# Altium schematic sheet ip_phone_d_lcd_keyboard.SchDoc: LCD e Display
size A3; SheetNumber: 4; SheetTotal: 6
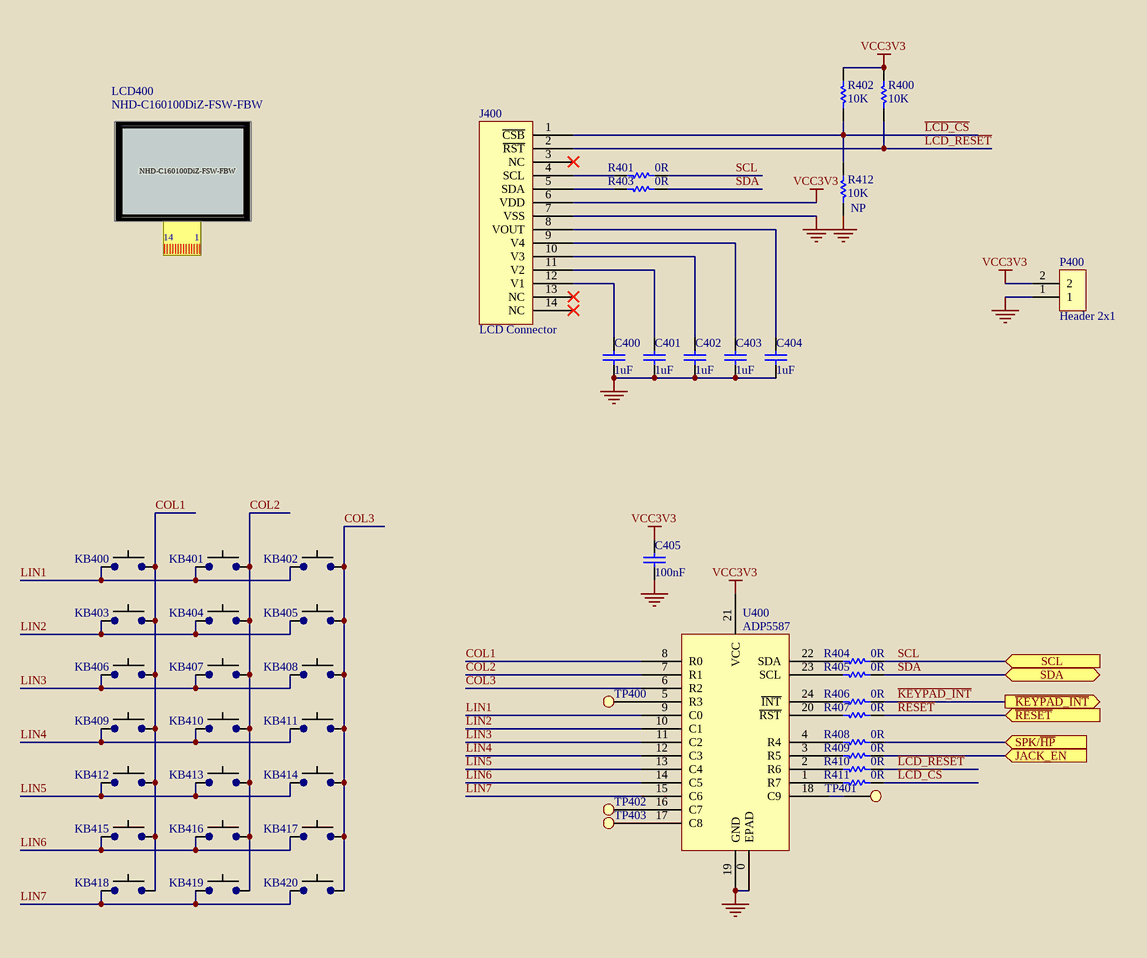
[diagram p0: ip_phone_d_lcd_keyboard.SchDoc]

## Parts
C400  1uF  [CC1005-0402]
C401  1uF  [CC1005-0402]
C402  1uF  [CC1005-0402]
C403  1uF  [CC1005-0402]
C404  1uF  [CC1005-0402]
C405  100nF  [CC1005-0402]
J400  LCD Connector  [LCD_Connector]
KB400  Keypad_Button  [Keypad_Button]  (value not drawn)  (no BOM)
KB401  Keypad_Button  [Keypad_Button]  (value not drawn)  (no BOM)
KB402  Keypad_Button  [Keypad_Button]  (value not drawn)  (no BOM)
KB403  Keypad_Button  [Keypad_Button]  (value not drawn)  (no BOM)
KB404  Keypad_Button  [Keypad_Button]  (value not drawn)  (no BOM)
KB405  Keypad_Button  [Keypad_Button]  (value not drawn)  (no BOM)
KB406  Keypad_Button  [Keypad_Button]  (value not drawn)  (no BOM)
KB407  Keypad_Button  [Keypad_Button]  (value not drawn)  (no BOM)
KB408  Keypad_Button  [Keypad_Button]  (value not drawn)  (no BOM)
KB409  Keypad_Button  [Keypad_Button]  (value not drawn)  (no BOM)
KB410  Keypad_Button  [Keypad_Button]  (value not drawn)  (no BOM)
KB411  Keypad_Button  [Keypad_Button]  (value not drawn)  (no BOM)
KB412  Keypad_Button  [Keypad_Button]  (value not drawn)  (no BOM)
KB413  Keypad_Button  [Keypad_Button]  (value not drawn)  (no BOM)
KB414  Keypad_Button  [Keypad_Button]  (value not drawn)  (no BOM)
KB415  Keypad_Button  [Keypad_Button]  (value not drawn)  (no BOM)
KB416  Keypad_Button  [Keypad_Button]  (value not drawn)  (no BOM)
KB417  Keypad_Button  [Keypad_Button]  (value not drawn)  (no BOM)
KB418  Keypad_Button  [Keypad_Button]  (value not drawn)  (no BOM)
KB419  Keypad_Button  [Keypad_Button]  (value not drawn)  (no BOM)
KB420  Keypad_Button  [Keypad_Button]  (value not drawn)  (no BOM)
LCD400  NHD-C160100DiZ-FSW-FBW  (mechanical)
P400  Header 2x1  [HEADER 2X1]
R400  10K  [CR1005-0402]
R401  0R  [CR1005-0402]
R402  10K  [CR1005-0402]
R403  0R  [CR1005-0402]
R404  0R  [CR1005-0402]
R405  0R  [CR1005-0402]
R406  0R  [CR1005-0402]
R407  0R  [CR1005-0402]
R408  0R  [CR1005-0402]
R409  0R  [CR1005-0402]
R410  0R  [CR1005-0402]
R411  0R  [CR1005-0402]
R412  10K  [CR1005-0402]
TP400  Test Point  [Test Point]  (value not drawn)  (no BOM)
TP401  Test Point  [Test Point]  (value not drawn)  (no BOM)
TP402  Test Point  [Test Point]  (value not drawn)  (no BOM)
TP403  Test Point  [Test Point]  (value not drawn)  (no BOM)
U400  ADP5587  [QFN-24]

## Ports
JACK_EN (in), SCL (in), SDA (bidir), SPK/~{HP} (in), ~{KEYPAD_INT} (out), ~{RESET} (in)

## Nets
GND: C400.2 C401.2 C402.2 C403.2 C404.2 C405.1 J400.7(VSS) P400.1 R412.1 U400.0(EPAD) U400.19(GND)
VCC3V3: C405.2 J400.6(VDD) P400.2 R400.2 R402.2 U400.21(VCC)
~{KEYPAD_INT}: R406.1 ; port ~{KEYPAD_INT}
~{RESET}: R407.1 ; port ~{RESET}
COL1: KB400.2 KB403.2 KB406.2 KB409.2 KB412.2 KB415.2 KB418.2 U400.8(R0)
COL2: KB401.2 KB404.2 KB407.2 KB410.2 KB413.2 KB416.2 KB419.2 U400.7(R1)
COL3: KB402.2 KB405.2 KB408.2 KB411.2 KB414.2 KB417.2 KB420.2 U400.6(R2)
JACK_EN: R409.1 ; port JACK_EN
~{LCD_CS}: J400.1(~{CSB}) R402.1 R411.1 R412.2
~{LCD_RESET}: J400.2(~{RST}) R400.1 R410.1
LIN1: KB400.1 KB401.1 KB402.1 U400.9(C0)
LIN2: KB403.1 KB404.1 KB405.1 U400.10(C1)
LIN3: KB406.1 KB407.1 KB408.1 U400.11(C2)
LIN4: KB409.1 KB410.1 KB411.1 U400.12(C3)
LIN5: KB412.1 KB413.1 KB414.1 U400.13(C4)
LIN6: KB415.1 KB416.1 KB417.1 U400.14(C5)
LIN7: KB418.1 KB419.1 KB420.1 U400.15(C6)
SCL: R401.1 R404.1 ; port SCL
SDA: R403.1 R405.1 ; port SDA
SPK/~{HP}: R408.1 ; port SPK/~{HP}
NetC400_1: C400.1 J400.12(V1)
NetC401_1: C401.1 J400.11(V2)
NetC402_1: C402.1 J400.10(V3)
NetC403_1: C403.1 J400.9(V4)
NetC404_1: C404.1 J400.8(VOUT)
NetJ400_4: J400.4(SCL) R401.2
NetJ400_5: J400.5(SDA) R403.2
NetR404_2: R404.2 U400.22(SDA)
NetR405_2: R405.2 U400.23(SCL)
NetR406_2: R406.2 U400.24(~{INT})
NetR407_2: R407.2 U400.20(~{RST})
NetR408_2: R408.2 U400.4(R4)
NetR409_2: R409.2 U400.3(R5)
NetR410_2: R410.2 U400.2(R6)
NetR411_2: R411.2 U400.1(R7)
NetTP400_1: TP400.1 U400.5(R3)
NetTP401_1: TP401.1 U400.18(C9)
NetTP402_1: TP402.1 U400.16(C7)
NetTP403_1: TP403.1 U400.17(C8)

Not connected (* = marked no-connect by the designer): J400 3(NC)* 13(NC)* 14(NC)*

## Notes on the sheet
- Título:
- Universidade Federal do Ceará
- Padrão:
- Projeto:
- A3
- Blackfin IP Phone
- Data:
- Versão:
- Folha:
- V1
- de
- Centro de Tecnologia
- Dep. de Eng. de Teleinformática
- Fortaleza - Ceará - Brasil
- Arquivo:
- (in symbol LCD) 14; 1

## Library data of the parts
C400-C404 = Capacitor: CAP CER 1.0UF 6.3V 20% X5R 0402; eVendorPart#: 490-1319-1-ND; Manufacturer: Murata Electronics North America; Part#: GRM155R60J105ME19D; eVendor: Digikey; eVendorPrice: 0,055; MSRP: 0,01193; MOQ: 1000
C405 = Capacitor: MLCC - SMD/SMT 0.1UF 16V 10% 0402; eVendorPart#: 810-C1005X7R1C104K; Manufacturer: TDK; Part#: C1005X7R1C104KT; eVendor: Mouser; eVendorPrice: 0,03; MSRP: 0,005; MOQ: 1000
J400 = LCD Connector: eVendorPart#: 538-52892-1495; Manufacturer: Molex; Part#: 52892-1495; eVendor: Mouser; eVendorPrice: 1,27; MSRP: 0,45; MOQ: 1000
LCD400 = LCD: eVendorPart#: 763-C160100DIZFSWFBW; Manufacturer: Newhaven Display; eVendor: Mouser; eVendorPrice: 18,55; MSRP: 15,39; Part#: NHD-C160100DiZ-FSW-FBW; MOQ: 50
P400 = CON_HEADER_2X1: CONN HEADER SH 2POS SIDE 1MM TIN; eVendorPart#: 455-1802-1-ND; Manufacturer: JST Sales America Inc; Part#: SM02B-SRSS-TB(LF)(SN); eVendor: Digikey; eVendorPrice: 0,38; MSRP: 0,23142; MOQ: 500
R400 R402 R412 = Resistor: Thick Film Resistors SMD 0402 10K 5%  1/16 W; eVendorPart#: 311-10KJRCT-ND; Manufacturer: Yageo; Part#: RC0402JR-0710KL; eVendor: Digikey; eVendorPrice: 0,012; MSRP: 0,00253; MOQ: 1000
  R402 R412: NP: NP
R401 R403-R411 = Resistor: Thick Film Resistors 0402 1/16W Jumper; eVendorPart#: 667-ERJ-2GE0R00X; Manufacturer: Panasonic Electronic Components; Part#: ERJ-2GE0R00X; eVendor: Mouser; eVendorPrice: 0,05; MSRP: 0,004; MOQ: 1000
TP400-TP403 = Test Point: eVendor: NÃO SE APLICA; eVendorPrice: 0,00; eVendorPart#: NÃO SE APLICA; Part#: NÃO SE APLICA; Manufacturer: NÃO SE APLICA; MOQ: 1000; MSRP: 0,00
U400 = ADP5587: IC Expander/Keyboard Controller; eVendorPart#: ADP5587ACPZ-R7CT-ND; Part#: ADP5587ACPZ-R7; Manufacturer: Analog Devices; eVendor: Digikey; MSRP: 1,725; eVendorPrice: 3,45; MOQ: 1000
KB400-KB420 = Keypad_Button: eVendor: *; eVendorPart#: *; Part#: *; eVendorPrice: *; MOQ: *; MSRP: *; Manufacturer: *